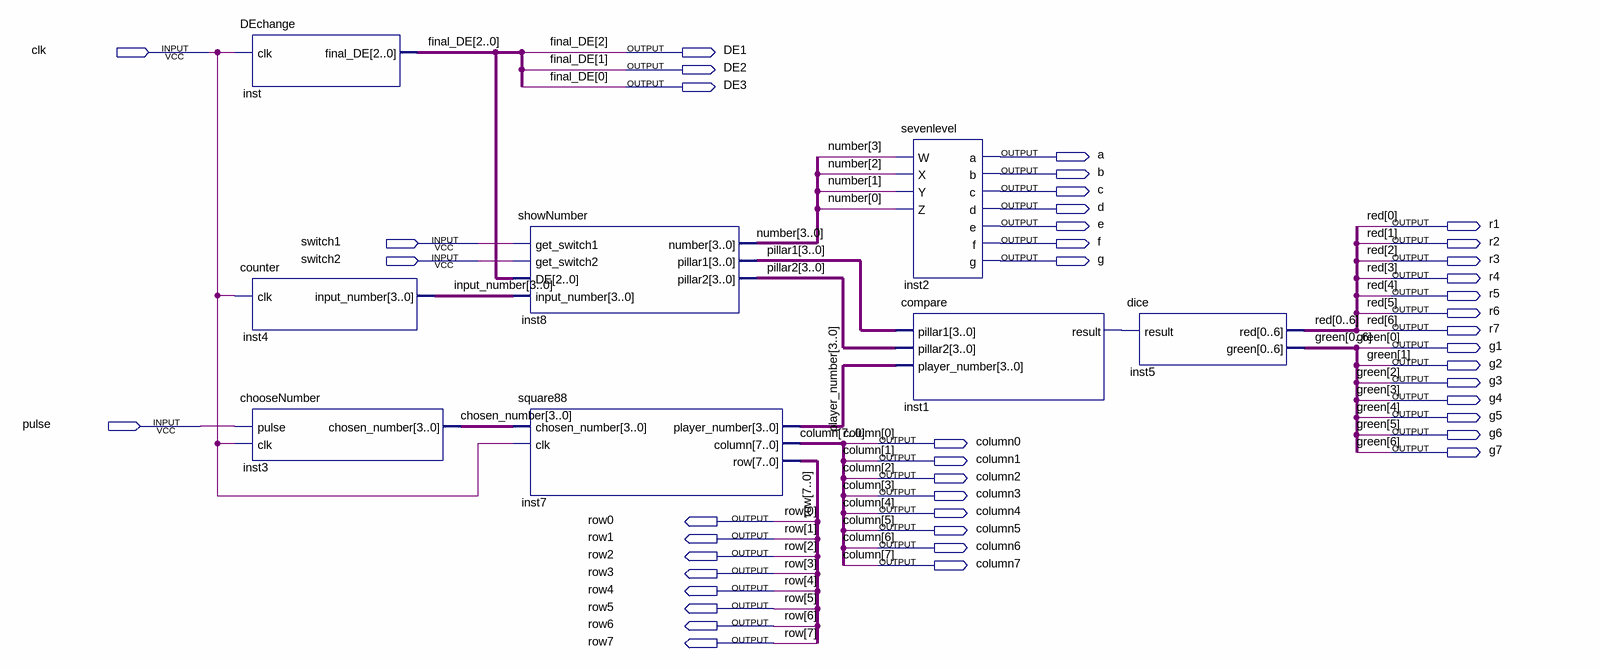
[diagram p0: schematic sheet]
// Quartus schematic final_project.bdf as structural Verilog: 8 symbols, 44 pins
module final_project (
  input  clk,
  input  switch1,
  input  switch2,
  input  pulse,
  output DE1,
  output DE2,
  output DE3,
  output a,
  output b,
  output c,
  output d,
  output e,
  output r1,
  output f,
  output r2,
  output g,
  output r3,
  output r4,
  output r5,
  output r6,
  output r7,
  output g1,
  output g2,
  output g3,
  output g4,
  output g5,
  output g6,
  output column0,
  output g7,
  output column1,
  output column2,
  output column3,
  output column4,
  output row0,
  output column5,
  output row1,
  output column6,
  output row2,
  output column7,
  output row3,
  output row4,
  output row5,
  output row6,
  output row7
);

  wire inst1_result;
  wire [3:0] chosen_number, input_number, number, pillar1, pillar2, player_number;

  DEchange inst (.clk(clk), .final_DE({DE1, DE2, DE3}));
  counter inst4 (.clk(clk), .input_number(input_number));
  chooseNumber inst3 (.pulse(pulse), .clk(clk), .chosen_number(chosen_number));
  showNumber inst8 (
    .get_switch1(switch1), .get_switch2(switch2), .DE({DE1, DE2, DE3}), .input_number(input_number),
    .number(number), .pillar1(pillar1), .pillar2(pillar2));
  square88 inst7 (
    .chosen_number(chosen_number), .clk(clk), .player_number(player_number),
    .column({column7, column6, column5, column4, column3, column2, column1, column0}),
    .row({row7, row6, row5, row4, row3, row2, row1, row0}));
  sevenlevel inst2 (
    .W(number[3]), .X(number[2]), .Y(number[1]), .Z(number[0]), .a(a), .b(b), .c(c), .d(d), .e(e), .f(f),
    .g(g));
  compare inst1 (.pillar1(pillar1), .pillar2(pillar2), .player_number(player_number), .result(inst1_result));
  dice inst5 (.result(inst1_result), .red({r1, r2, r3, r4, r5, r6, r7}), .green({g1, g2, g3, g4, g5, g6, g7}));

  // Other names for the same wires on the sheet: final_DE[2:0] = {DE1, DE2, DE3};
  //   green[6:0] = {g7, g6, g5, g4, g3, g2, g1}; red[6:0] = {r7, r6, r5, r4, r3, r2, r1}
endmodule
